# Altium schematic sheet alimentacion.SchDoc
size A4
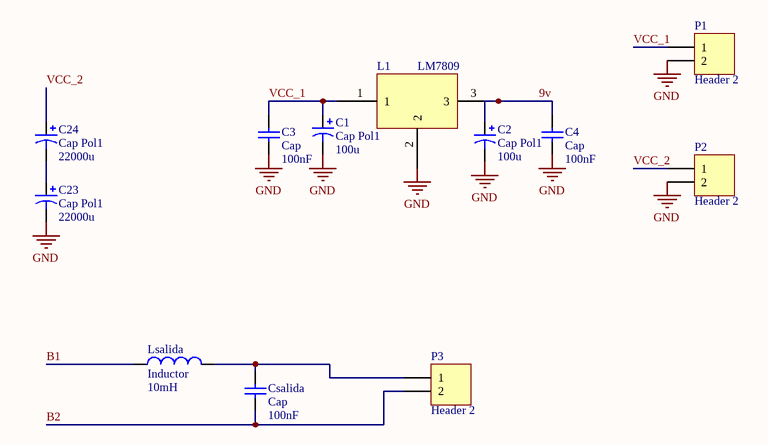
[diagram p0: alimentacion.SchDoc]

## Parts
C1  Cap Pol1  value 100u  [A]
C2  Cap Pol1  value 100u  [A]
C3  Cap  value 100nF  [C1206]
C4  Cap  value 100nF  [C1206]
C23  Cap Pol1  value 22000u  [Capacitor gigante]
C24  Cap Pol1  value 22000u  [Capacitor gigante]
Csalida  Cap  value 100nF  [A]
L1  LM7809  [TO-220AB]
Lsalida  Inductor  value 10mH  [A]
P1  Header 2  [HDR1X2]
P2  Header 2  [HDR1X2]
P3  Header 2  [HDR1X2]

## Nets
GND: C1.2 C2.2 C3.1 C4.1 C23.2 L1.2 P1.2 P2.2
9v: C2.1 C4.2 L1.3
B1: Lsalida.1
B2: Csalida.1 P3.2
VCC_1: C1.1 C3.2 L1.1 P1.1
VCC_2: C24.1 P2.1
NetC23_1: C23.1 C24.2
NetCsalida_2: Csalida.2 Lsalida.2 P3.1

## Library data of the parts
C1 C2 C23 C24 = Cap Pol1: Polarized Capacitor (Radial); Published: 8-Jun-2000; LatestRevisionDate: 17-Jul-2002; LatestRevisionNote: Re-released for DXP Platform.; PackageReference: RB7.6-15; Publisher: Altium Limited
C3 C4 Csalida = Cap: Capacitor; Published: 8-Jun-2000; LatestRevisionDate: 17-Jul-2002; LatestRevisionNote: Re-released for DXP Platform.; PackageReference: RAD-0.3; Publisher: Altium Limited
Lsalida = Inductor: Code_IEC: 1005; Published: 8-Jun-2000; LatestRevisionDate: 17-Jul-2002; LatestRevisionNote: Re-released for DXP Platform.; PackageReference: 0402-A; Publisher: Altium Limited; Code_JEITA: 0402
P1-P3 = Header 2: Header, 2-Pin; LatestRevisionDate: 17-Jul-2002; LatestRevisionNote: Re-released for DXP Platform.; Publisher: Altium Limited